# EAGLE design PwrSwHs1_0 (EAGLE 6.3)
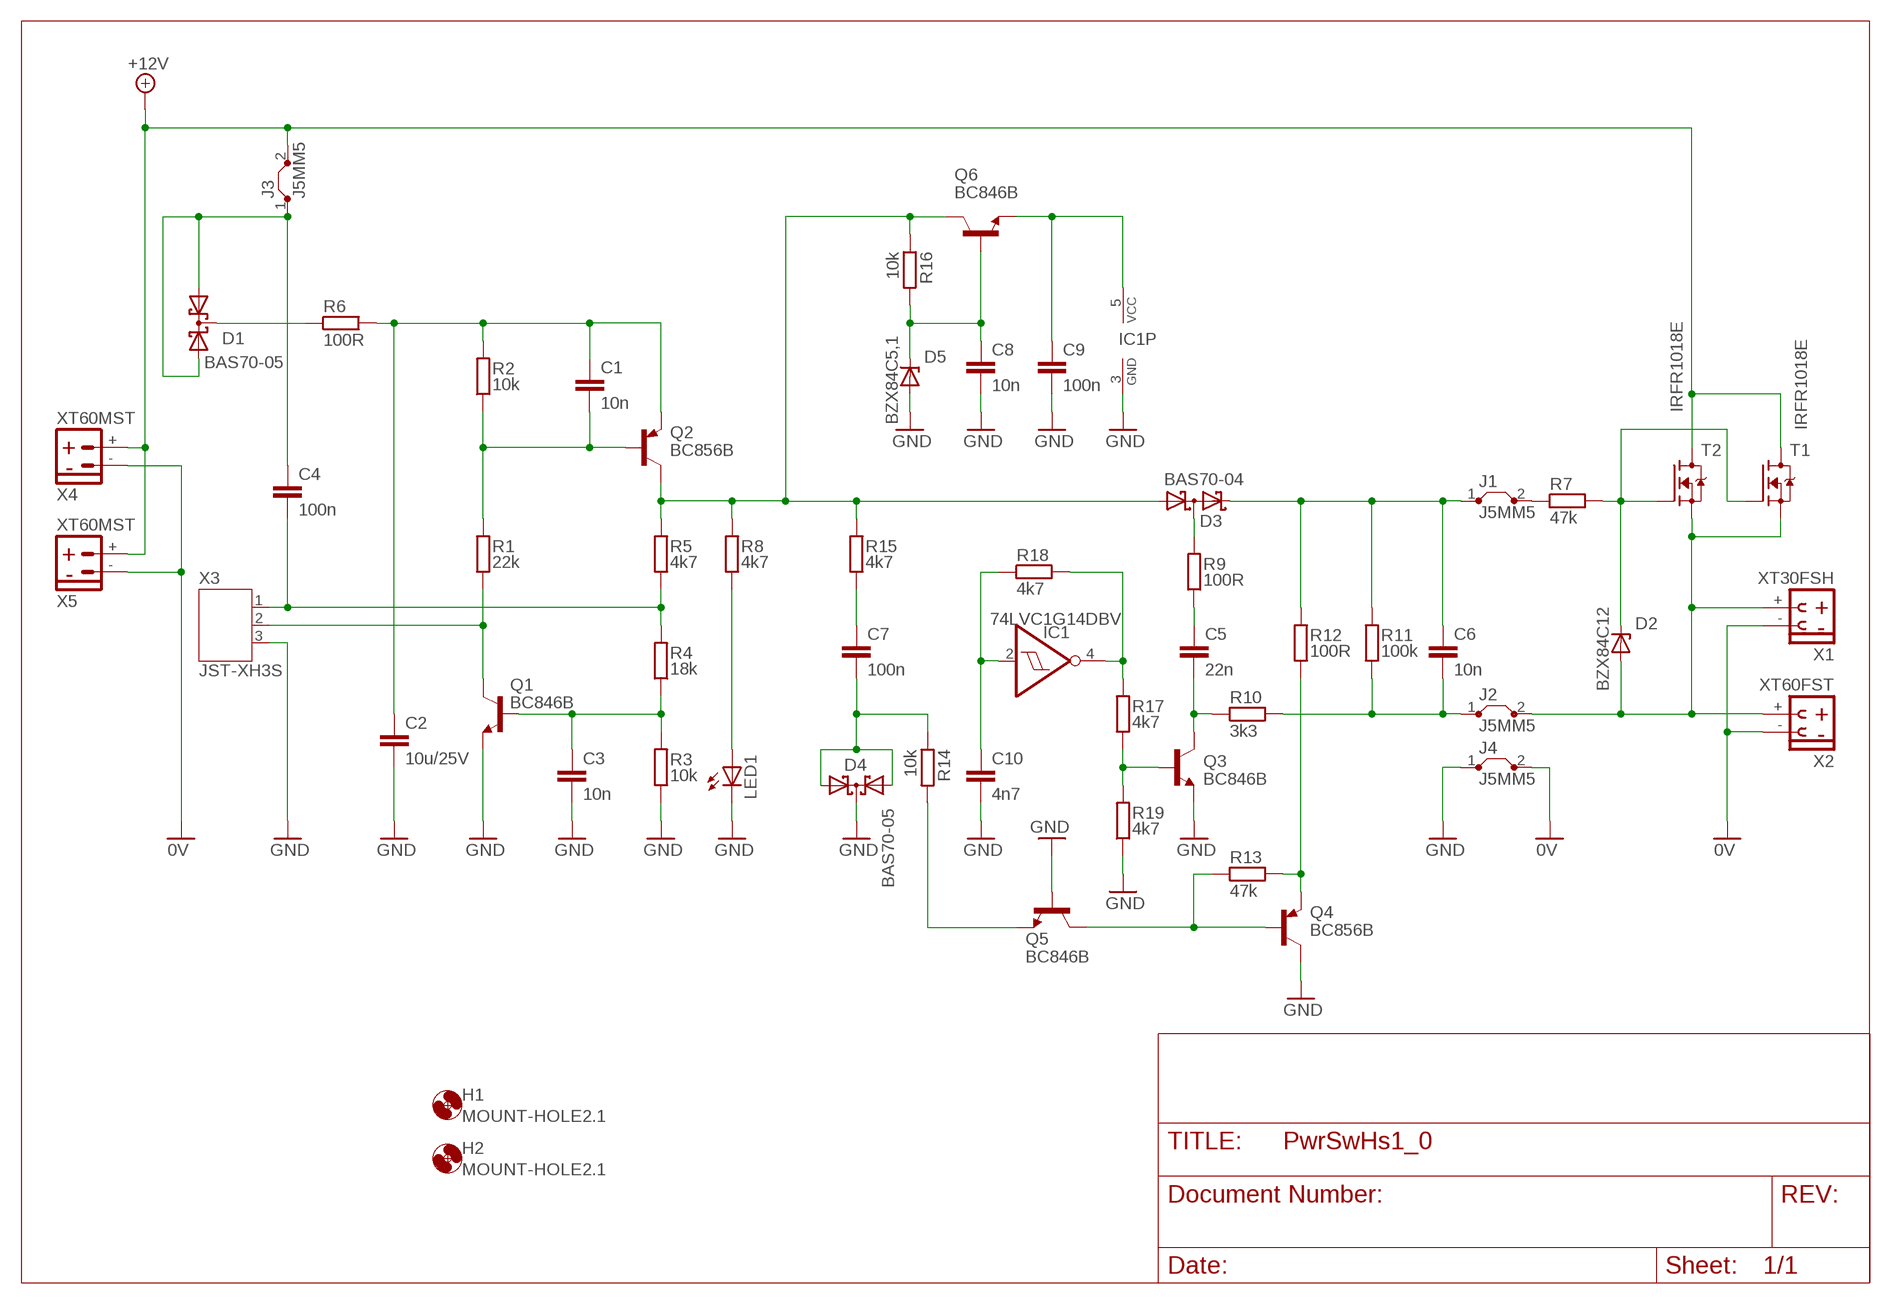
[diagram p0: schematic, sheet 1]

## Parts
C1  10n  C-EUC0805  [C0805]
C2  10u/25V  C-EUC1210  [C1210]
C3  10n  C-EUC0805  [C0805]
C4  100n  C-EUC0805  [C0805]
C5  22n  C-EUC0805  [C0805]
C6  10n  C-EUC0805  [C0805]
C7  100n  C-EUC0805  [C0805]
C8  10n  C-EUC0805  [C0805]
C9  100n  C-EUC0805  [C0805]
C10  4n7  C-EUC0805  [C0805]
D1  BAS70-05  [SOT23]
D2  BZX84C12  BZX84CSMD  [TO236]
D3  BAS70-04  [SOT23]
D4  BAS70-05  [SOT23]
D5  BZX84C5,1  BZX84CSMD  [TO236]
H1  MOUNT-HOLE2.1  [2,1]
H2  MOUNT-HOLE2.1  [2,1]
IC1  74LVC1G14DBV  [SOT23-5]
J1  J5MM5  [053]
J2  J5MM5  [053]
J3  J5MM5  [053]
J4  J5MM5  [053]
LED1  LEDLED3MML  [LED3MML]
Q1  BC846B  BC846BSMD  [SOT23]
Q2  BC856B  BC856BSMD  [SOT23-BEC]
Q3  BC846B  BC846BSMD  [SOT23]
Q4  BC856B  BC856BSMD  [SOT23-BEC]
Q5  BC846B  BC846BSMD  [SOT23]
Q6  BC846B  BC846BSMD  [SOT23]
R1  22k  R-EU_R0805  [R0805]
R2  10k  R-EU_R0805  [R0805]
R3  10k  R-EU_R0805  [R0805]
R4  18k  R-EU_R0805  [R0805]
R5  4k7  R-EU_R0805  [R0805]
R6  100R  R-EU_R0805  [R0805]
R7  47k  R-EU_R0805  [R0805]
R8  4k7  R-EU_R0805  [R0805]
R9  100R  R-EU_R0805  [R0805]
R10  3k3  R-EU_R0805  [R0805]
R11  100k  R-EU_R0805  [R0805]
R12  100R  R-EU_R0805  [R0805]
R13  47k  R-EU_R0805  [R0805]
R14  10k  R-EU_R0805  [R0805]
R15  4k7  R-EU_R0805  [R0805]
R16  10k  R-EU_R0805  [R0805]
R17  4k7  R-EU_R0805  [R0805]
R18  4k7  R-EU_R0805  [R0805]
R19  4k7  R-EU_R0805  [R0805]
T1  IRFR1018E  MOSFET-N-CHTO252  [TO252]
T2  IRFR1018E  MOSFET-N-CHTO252  [TO252]
X1  XT30FSH  [XT30F-SH]
X2  XT60FST  [XT60F-ST]
X3  JST-XH3S  [JST-XH3SMD]
X4  XT60MST  [XT60M-ST]
X5  XT60MST  [XT60M-ST]

## Nets
0V: J4.2 X1.- X2.- X4.- X5.-
+4V5: C9.1 IC1.5(VCC) Q6.2(E)
+12V: J3.2 T1.3(D) T2.3(D) X4.+ X5.+
+12V_SW: D3.1(A1) Q2.C Q6.3(C) R5.2 R8.2 R15.2 R16.1
+12VB: C4.1 D1.1(A1) D1.2(A2) J3.1
GATE: C6.1 D3.2(C2) J1.1 R11.2 R12.2
GATE_LIM: D2.C R7.2 T1.1(G) T2.1(G)
GATEB: J1.2 R7.1
GND: C2.2 C3.2 C8.2 C9.2 C10.2 D4.3(C) D5.A IC1.3(GND) J4.1 LED1.K(C) Q1.2(E) Q3.2(E) Q4.C Q5.1(B) R3.1 R19.1 X3.3
N$1: LED1.A R8.1
N$2: C5.2 Q3.3(C) R10.1
N$3: D3.3(C1A2) R9.2
N$4: C5.1 R9.1
N$5: C1.2 Q2.B R1.2 R2.1
N$6: C1.1 C2.1 Q2.E R2.2 R6.2
N$8: C3.1 Q1.1(B) R3.2 R4.1
N$10: C7.2 D4.1(A1) D4.2(A2) R14.1
N$11: Q3.1(B) R17.1 R19.2
N$12: Q4.E R12.1 R13.2
N$13: D1.3(C) R6.1
N$14: Q4.B Q5.3(C) R13.1
N$15: C7.1 R15.1
N$17: Q5.2(E) R14.2
N$18: C8.1 D5.C Q6.1(B) R16.2
N$21: C10.1 IC1.2(I) R18.1
N$22: IC1.4(O) R17.2 R18.2
OFF: C4.2 R4.2 R5.1 X3.1
ON: Q1.3(C) R1.1 X3.2
V_OUT: C6.2 J2.1 R10.2 R11.1
V_OUTB: D2.A J2.2 T1.2(S) T2.2(S) X1.+ X2.+

## Library data of the parts
C1-C10 = rcl:C-EU: CAPACITOR, European symbol
D1 D4 = diode:BAS70-05: Silicon Schottky Diodes General-purpose diode for high-speed switching
D2 D5 = diode:BZX84CSMD: Z DIODE
D3 = diode:BAS70-04: Silicon Schottky Diodes General-purpose diode for high-speed switching
H1 H2 = holes:MOUNT-HOLE: MOUNTING HOLE with drill center marker
IC1 = 74xx-little-de:74*1G14: Single Schmitt-Trigger Inverter Gate
J1-J4 = jumper:J: Bridge
LED1 = led:LED: LED OSRAM: - CHIPLED LG R971, LG N971, LY N971, LG Q971, LY Q971, LO R971, LY R971 LH N974, LH R974 LS Q976, LO Q976, LY Q976 LO Q996 - Hyper CHIPLED LW Q18S LB Q993, LB Q99A, LB R99A - SideLED LS A670, LO A670, LY A670, LG A670, LP A670 LB A673, LV A673, LT A673, LW A673 LH A674 LY A675 LS A676, LA A676, LO A676, LY A676, LW A676 LS A679, LY A679, LG A679 - Hyper Micro SIDELED® LS Y876, LA Y876, LO Y876, LY Y876 LT Y87S - SmartLED LW L88C, LW L88S LB L89C, LB L89S, LG L890 LS L89K, LO L89K, LY L89K LS L896, LA L896, LO L896, LY L896 - TOPLED LS T670, LO T670, LY T670, LG T670, LP T670 LSG T670, LSP T670, LSY T670, LOP T670, LYG T670 LG T671, LOG T671, LSG T671 LB T673, LV T673, LT T673, LW T673 LH T674 LS T676, LA T676, LO T676, LY T676, LB T676, LH T676, LSB T676, LW T676 LB T67C, LV T67C, LT T67C, LS T67K, LO T67K, LY T67K, LW E67C LS E67B, LA E67B, LO E67B, LY E67B, LB E67C, LV E67C, LT E67C LW T67C LS T679, LY T679, LG T679 LS T770, LO T770, LY T770, LG T770, LP T770 LB T773, LV T773, LT T773, LW T773 LH T774 LS E675, LA E675, LY E675, LS T675 LS T776, LA T776, LO T776, LY T776, LB T776 LHGB T686 LT T68C, LB T68C - Hyper Mini TOPLED® LB M676 - Mini TOPLED Santana® LG M470 LS M47K, LO M47K, LY M47K Source: http://www.osram.convergy.de LUXEON: - LUMILED® LXK2-PW12-R00, LXK2-PW12-S00, LXK2-PW14-U00, LXK2-PW14-V00 LXK2-PM12-R00, LXK2-PM12-S00, LXK2-PM14-U00 LXK2-PE12-Q00, LXK2-PE12-R00, LXK2-PE12-S00, LXK2-PE14-T00, LXK2-PE14-U00 LXK2-PB12-K00, LXK2-PB12-L00, LXK2-PB12-M00, LXK2-PB14-N00, LXK2-PB14-P00, LXK2-PB14-Q00 LXK2-PR12-L00, LXK2-PR12-M00, LXK2-PR14-Q00, LXK2-PR14-R00 LXK2-PD12-Q00, LXK2-PD12-R00, LXK2-PD12-S00 LXK2-PH12-R00, LXK2-PH12-S00 LXK2-PL12-P00, LXK2-PL12-Q00, LXK2-PL12-R00 Source: www.luxeon.com KINGBRIGHT: KA-3528ASYC Source: www.kingbright.com
Q1 Q3 Q5 Q6 = transistor-npn:BC846*: NPN Transistor
Q2 Q4 = transistor-pnp:BC856*: PNP Transistror
R1-R19 = rcl:R-EU_: RESISTOR, European symbol
T1 T2 = transistor-fet:MOSFET-N-CH
X1 = con-accu:XT30F
X2 = con-accu:XT60F
X3 = jst-ph-xh:JST-XH3
X4 X5 = con-accu:XT60M

## Board
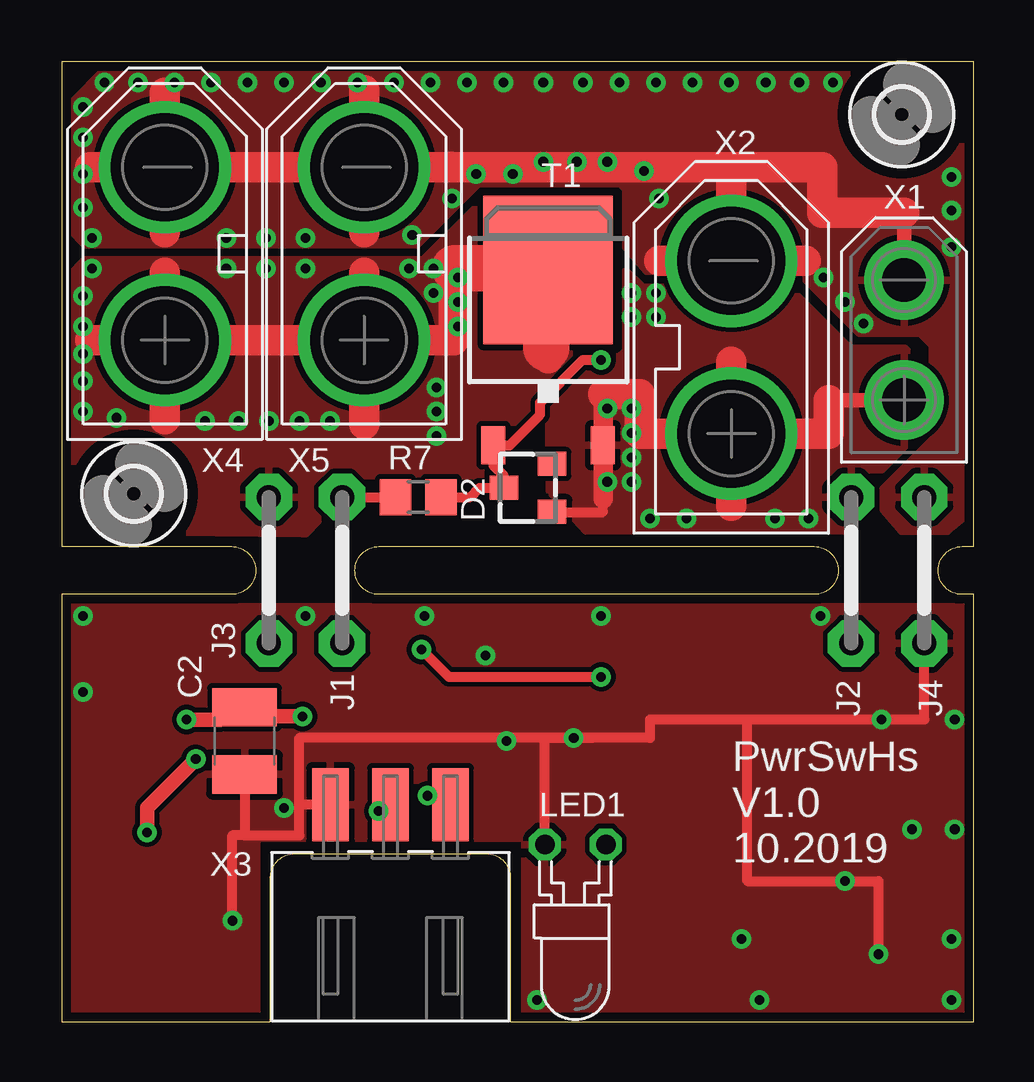
[diagram p1: board, top side]
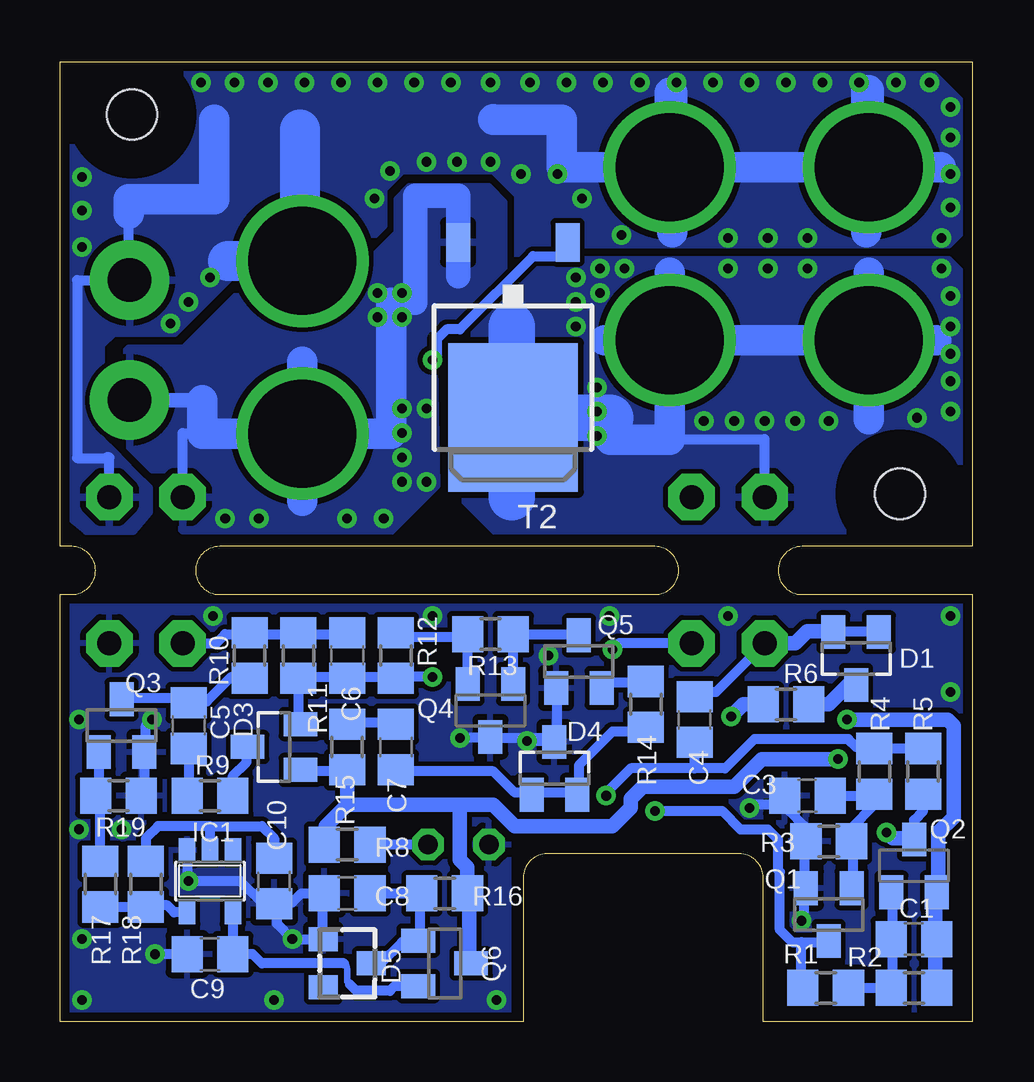
[diagram p2: board, bottom side, seen from below]

Size 38 x 40 mm. Coordinates in mm from the lower left corner, seen from the top.
Outline: 38,19.8 38,40 0,40 0,19.8 7.08,19.8 arc-180 7.08,17.8 0,17.8 0,0 8.7,0 8.7,6 arc-90 9.7,7 17.7,7 arc-90 18.7,6 18.7,0 38,0 38,17.8 37.52,17.8 arc-180 37.52,19.8 38,19.8
Outline: 13.22,19.8 31.35,19.8 arc-180 31.35,17.8 13.22,17.8 arc-180 13.22,19.8
Copper layers (1*16): Top 0.035mm / dielectric 1.5mm / Bottom 0.035mm
Design rules "default *": minimum track width 5mil, minimum drill 10mil, track to track 8mil, track to pad 8mil, pad to pad 8mil, via to via 8mil, smd to smd 5mil, copper to edge 15mil, drill to drill 8mil, minimum pad ring 10mil, minimum via ring 8mil, stop-mask expansion 4mil, vias tented up to drill 0.6mm, thermal gap 10mil
Milling: 22 lines

### Footprints (pad centres in the part's own frame; a part is rotated, then mirrored left to right if it is on the bottom)
C0805 = smd 1.3 x 1.5: 1 -0.95,0; 2 0.95,0
C1210 = smd 1.6 x 2.7: 1 -1.4,0; 2 1.4,0
SOT23 = smd 1 x 1.4: 1 -0.95,-1.1; 2 0.95,-1.1; 3 0,1.1
TO236 = smd 1 x 1.2: A -1,-1; C 0,1; NC 1,-1
2,1 = hole 2.1: 0,0
SOT23-5 = smd 0.69 x 0.99: 1 -0.95,-1.29; 2 0,-1.29; 3 0.95,-1.29; 4 0.95,1.3; 5 -0.95,1.3
053 = drill 1 pad 1.93 octagon: 1 -3.048,0; 2 3.048,0
LED3MML = drill 0.813 octagon: A -1.27,0; K 1.27,0
SOT23-BEC = smd 1 x 1.4: B -0.95,-1.1; C 0,1.1; E 0.95,-1.1
R0805 = smd 1.3 x 1.5: 1 -0.95,0; 2 0.95,0
TO252 = smd 1 x 1.6: 1 -2.28,-4.8; 2 2.28,-4.8 | smd 5.4 x 6.2: 3 0,2.5
XT30F-SH = drill 1.8 pad 3.3: + -0.1,2.5; - -0.1,-2.5
XT60F-ST = drill 4.5: + 0,3.6; - 0,-3.6
JST-XH3SMD = smd 1.524 x 3.048: 1 -2.5,-4.5; 2 0,-4.5; 3 2.5,-4.5
XT60M-ST = drill 4.5: + 0,3.6; - 0,-3.6

### Placement (x,y rotation side)
C1  2.41,3.45 180 bottom
C2  7.62,11.7 270 top
C3  6.86,9.41 180 bottom
C4  11.56,12.59 270 bottom
C5  32.64,12.34 90 bottom
C6  26.04,15.26 90 bottom
C7  24,11.45 270 bottom
C8  26.04,5.35 180 bottom
C9  31.75,2.81 180 bottom
C10  29.08,5.86 270 bottom
D1  4.83,15.13 180 bottom
D2  19.43,22.24 90 top
D3  29.08,11.45 90 bottom
D4  17.4,10.56 0 bottom
D5  26.04,2.43 270 bottom
H1  35,37.8 0 top
H2  3,22 0 top
IC1  31.75,5.86 180 bottom
J1  11.68,18.81 90 top
J2  32.89,18.81 90 top
J3  8.64,18.81 90 top
J4  35.94,18.81 90 top
LED1  21.4,7.38 180 top
Q1  5.97,4.46 180 bottom
Q2  2.41,6.49 0 bottom
Q3  35.43,12.34 0 bottom
Q4  20.07,12.97 180 bottom
Q5  16.38,15 0 bottom
Q6  21.97,2.43 270 bottom
R1  6.1,1.41 0 bottom
R2  2.41,1.41 0 bottom
R3  5.97,7.51 0 bottom
R4  4.06,10.43 90 bottom
R5  2.03,10.43 270 bottom
R6  7.75,13.22 180 bottom
R7  14.86,21.86 0 top
R8  26.04,7.38 180 bottom
R9  31.75,9.41 0 bottom
R10  30.1,15.26 90 bottom
R11  28.07,15.26 270 bottom
R12  24,15.26 270 bottom
R13  20.07,16.14 180 bottom
R14  13.59,13.22 90 bottom
R15  26.04,11.45 270 bottom
R16  21.97,5.35 180 bottom
R17  36.32,5.73 270 bottom
R18  34.42,5.73 270 bottom
R19  35.56,9.41 180 bottom
T1  20.27,28.82 0 top
T2  19.13,27.67 180 bottom
X1  35,28.4 180 top
X2  27.9,28.1 180 top
X3  13.7,4.54 180 top
X4  4.3,32 180 top
X5  12.6,32 180 top

### Tracks (layer width: path | path; a pad name or v marks a point on that pad's centre or on a via)
0V  (via drill 0.4 pad 0.81)
  Top 0.61: X1.- 35.1,33.7
  Top 1.27: 12.6,38.8 X5.- | 12.6,32.9 X5.- | X5.- X4.- | X4.- 4.3,32.9 | 4.3,38.7 X4.- | 1.2,35.6 X4.- | X5.- 16.21,35.6 16.21,35.62 | X2.- 31,31.7 | 24.9,31.7 X2.- | X2.- 27.9,35.6 | 27.9,35.6 16.3,35.6 | 35.1,33.7 31.7,33.7 31.7,35.6 27.9,35.6
  Bottom 0.406: 35.13,33.66 35.13,30.9 37.29,30.9 37.29,23.48 36.02,23.48 | J4.2 35.94,23.51 36.07,23.51
  Bottom 1.27: 1.3,35.6 X4.- 4.3,38.8 4.4,38.8 4.4,35.6 | 4.4,32.9 4.4,35.6 | 4.4,35.6 12.5,35.6 | 12.5,35.6 12.5,32.9 | 12.5,35.6 12.5,38.7 12.6,38.7 X5.- 17.09,35.6 17.09,37.58 19.94,37.58 19.94,37.61 | X2.- 28,31.7 28,31.8 | 35.13,33.66 35.13,34.28 31.57,34.28 31.57,37.58
  Bottom 1.676: 31,31.7 28,31.7 | 28,31.8 28,37.17
  other vias: 1.27,32.66 4.7,39.13 6.22,39.13 7.75,39.13 1.78,39.13 3.17,39.13 13.84,39.13 16.89,39.13 15.37,39.13 21.72,39.13 12.32,39.13 6.86,32.66 8.51,32.66 30.73,39.13 32.13,39.13 9.27,39.13 10.79,39.13 23.24,39.13 18.41,39.13 20.07,39.13 24.77,39.13 26.29,39.13 27.81,39.13 29.34,39.13 10.16,32.66 37.08,35.2 37.08,33.8 37.08,32.27 0.89,38.12 0.89,36.85 0.89,35.32 0.89,33.92 14.61,32.78 31.75,31 32.64,29.99 33.4,29.1 16.26,34.31 17.27,35.32 18.8,35.32 20.07,35.83 21.46,35.83 22.73,35.83 24.26,35.45 24.89,34.31
  pour Bottom (rank 5): 36.53,39.74 37.67,38.47 37.67,21.07 36.91,20.43 34.95,20.43 34.29,21.23 34.29,22.24 34.92,22.88 35.76,23.74 36.27,24.25 36.27,28.18 35.76,28.69 33.22,28.69 30.56,31.36 25.65,31.38 25.65,32.02 24.51,33.16 24.51,34.69 23.75,35.45 19.94,35.45 18.92,34.43 18.92,31.77 18.54,31.38 17.55,32.37 0.97,32.37 0.33,33.01 0.33,38.22 1.85,39.74
  pour Top: 36.91,20.43 37.67,21.07 37.67,38.47 36.53,39.74 1.85,39.74 0.33,38.22 0.33,33.01 0.97,32.37 14.81,32.37 17.35,34.91 23.32,34.91 23.32,34.86 23.5,34.69 23.5,32.27 24.38,31.26 30.68,31.23 33.22,28.69 35.76,28.69 36.27,28.18 36.27,24.25 34.24,22.21 34.24,21.32 35,20.43
+4V5
  Bottom 0.254: 25.91,1.54 26.04,1.67 | 26.04,2.17 26.04,2.3 26.16,2.43
  Bottom 0.279: 26.04,1.67 26.04,2.17
  Bottom 0.406: IC1.5 C9.1 29.97,2.81 29.59,2.43 26.16,2.43 | Q6.2 24.06,1.48 24.26,1.29 25.65,1.29 25.91,1.54
+12V  (via drill 0.4 pad 0.81)
  Top 0.813: 16.33,31.32 16.33,31.34 16.38,31.38
  Top 1.27: 12.6,31.2 X5.+ | 12.6,24.9 X5.+ | X5.+ X4.+ | 1.2,28.4 X4.+ | X4.+ 4.3,25.1 | 4.3,31.2 X4.+ | X5.+ 16.33,28.4 16.33,31.32 | T1.3 20.27,27.65
  Top 1.93: 20.19,28.08 20.19,31.38 16.38,31.38
  Bottom 0.406: J3.2 8.64,24.27 12.57,24.27
  Bottom 1.27: X5.+ 15.3,28.4 | X5.+ X4.+ | 4.3,31.2 X4.+ | 4.3,25.1 X4.+ | 1.5,28.4 X4.+ | X5.+ 12.6,31.2 | X5.+ 12.6,24.25 15.06,24.25 15.06,25.17 | 19.18,25.16 19.18,25.17 T2.3
  Bottom 1.93: 19.18,25.16 15.24,25.16 15.24,25.17 15.06,25.17 | 19.18,28.97 19.18,25.17 19.18,21.86
  other vias: 16.51,31 16.51,29.99 15.49,30.37 15.49,31.38 16.51,28.97 15.62,26.43 15.62,25.42 15.62,24.4 10.16,31.38 14.48,31.38 8.51,31.38 6.86,31.38 1.27,31.38 0.89,30.24 0.89,28.97 0.89,27.83 0.89,26.69 0.89,25.42 2.29,25.16 5.97,25.04 7.37,25.04 8.64,25.04 9.91,25.04 11.18,25.04
  pour Bottom: 19.89,20.43 16.51,20.46 0.97,20.43 0.33,21.07 0.33,31.1 0.97,31.74 17.81,31.74 arc-90 18.16,31.38 21.54,28.05 21.54,22.09
  pour Top (rank 3): 19.51,26.15 19.51,24.35 17.91,22.75 11.18,22.75 10.74,22.34 10.67,20.84 10.16,20.34 10.03,20.34 0.97,20.43 0.33,21.07 0.33,31.1 0.97,31.74 15.06,31.74 17.22,33.9 22.05,33.9 22.68,33.26 22.68,29.32
+12V_SW  (via drill 0.4 pad 0.81)
  Top 0.61: v5.59,10.94 3.56,8.91 v3.56,7.89
  Bottom 0.305: 2.46,7.64 Q2.C
  Bottom 0.406: R15.2 26.04,10.43 27.98,10.43 D3.1 | Q6.3 20.95,2.43 | 20.95,5.28 R16.1 | 26.92,7.44 R8.2 | Q2.C 2.41,8.4 2.03,8.78 R5.2
  Bottom 0.61: 20.95,2.43 20.95,5.28 | R16.1 21.02,6.43 21.34,6.75 21.34,9.03 | 21.34,9.03 26.04,9.03 | 26.04,9.03 26.92,8.14 26.92,7.44 | 26.04,10.43 26.04,9.03 | 21.34,9.03 19.94,9.03 19.05,8.14 14.99,8.14 14.22,8.91 14.22,9.29 13.72,9.79 9.91,9.79 8.76,10.94 v5.59,10.94 | v3.56,7.89 3.3,7.64 2.46,7.64
+12VB
  Bottom 0.406: 5.82,16.27 5.84,16.27 5.8,16.23 D1.2 5.82,16.27 | 5.82,16.27 3.92,16.27 D1.1 | J3.1 10.67,13.73 11.36,13.73 C4.1
  Bottom 0.61: 5.84,16.27 6.86,16.27 7.37,15.76 J3.1
GATE  (via drill 0.4, 0.4 pad 0.81)
  Top 0.406: v14.99,15.51 16.13,14.37 v22.48,14.37
  Bottom 0.406: D3.2 28.07,12.4 R11.2 28.07,14.37 26.04,14.37 | C6.1 26.04,14.37 | 26.04,14.37 24,14.37 R12.2 23.94,14.37 v22.48,14.37 | J1.1 14.73,15.76 v14.99,15.51
GATE_LIM  (via drill 0.4 pad 0.81)
  Top 0.406: R7.2 17.02,21.86 17.4,22.24 D2.C 18.41,22.26 18.41,22.75 17.99,23.17 T1.1 18.67,24.02 19.94,25.29 19.94,25.8 21.72,27.57 v22.48,27.57
  Bottom 0.406: T2.1 16.85,31.99 16.94,31.89 18.29,31.89 21.34,28.84 21.89,28.84 22.3,28.44 22.3,27.75 v22.48,27.57
GATEB
  Top 0.406: J1.2 R7.1
GND  (via drill 0.4 pad 0.81)
  Top 0.406: J4.1 35.94,12.59 v34.16,12.59 28.57,12.59 | v21.34,11.83 24.51,11.83 24.51,12.59 28.57,12.59 | v21.34,11.83 9.91,11.83 9.91,9.16 | 28.57,12.59 28.57,5.86 v32.64,5.86 34.04,5.86 v34.04,2.81 | v21.34,11.83 22.1,11.83 | 9.91,9.16 9.91,7.76 7.62,7.76 | LED1.K 20.13,11.83 v21.34,11.83 | v7.11,4.21 7.11,7.76 7.62,7.76 | X3.3 10.02,9.04 9.91,9.16 | C2.2 7.62,7.76
  Bottom 0.406: R19.1 34.48,9.54 Q3.2 34.48,11.25 34.42,11.32 34.42,12.34 v34.16,12.59 | C9.2 v34.04,2.81 | 20.07,11.83 v21.34,11.83 | IC1.3 32.7,5.92 v32.64,5.86 30.48,5.86 29.59,4.97 29.02,4.97 | 29.02,4.97 C10.2 | 27.04,5.3 C8.2 27.05,5.35 | 6.99,7.44 R3.1 6.99,7.51 | 6.99,7.51 7.11,7.51 7.11,7.64 6.99,7.51 | 17.4,13.9 Q5.1 17.27,13.84 17.27,11.7 17.36,11.7 D4.3 | Q4.C 20.07,11.83 | 20.07,11.83 17.4,11.83 D4.3 | 6.99,7.51 6.99,5.63 | 6.99,5.63 Q1.2 | v7.11,4.21 6.99,4.33 6.99,5.63 | 6.99,7.51 6.99,8.14 7.62,8.78 7.62,8.91 7.75,8.91 7.75,9.03 | 7.75,9.41 7.75,9.54 | 29.02,4.97 28.96,4.97 | 28.96,4.97 28.32,4.97 27.94,5.35 27.05,5.35 | 27.05,5.35 D5.A 28.3,3.43 | 7.93,9.54 C3.2 7.75,9.41 | v18.54,11.7 17.4,11.7 D4.3 | 7.75,9.41 7.75,9.03 | 7.75,9.03 9.27,9.03 v9.27,8.91 | v28.32,3.45 28.96,4.08 28.96,4.97
  other vias: 0.89,16.91 0.89,13.73 10.16,16.91 15.11,16.91 31.62,16.91 22.48,16.91 37.21,8.02 37.08,3.45 37.08,0.91 29.08,0.91 19.81,0.91 37.21,12.59 35.43,8.02 17.65,15.26
  pour Top: 0.25,17.29 0.25,0.27 8.13,0.23 8.13,7.64 19.3,7.64 19.3,0.27 37.72,0.27 37.72,17.29
  pour Bottom: 0.25,0.27 0.25,17.29 37.72,17.29 37.72,0.27 19.3,0.27 19.3,7.64 8.13,7.64 8.13,0.27
N$1
  Bottom 0.406: LED1.A R8.1
N$2
  Bottom 0.406: R10.1 30.1,14.37 30.86,14.37 31.88,13.35 32.57,13.35 C5.2 32.64,13.48 35.39,13.48 Q3.3
N$3
  Bottom 0.406: R9.2 30.8,10.24 30.23,10.81 30.23,11.4 D3.3
N$4
  Bottom 0.406: C5.1 32.64,9.47 R9.1
N$5
  Bottom 0.406: R1.2 R2.1 3.36,1.29 3.3,1.29 3.3,3.45 | C1.2 3.3,3.45 | 3.3,3.45 3.3,5.39 Q2.B
N$6  (via drill 0.4 pad 0.81)
  Top 0.406: 7.62,12.72 6.86,12.72 6.86,12.84 6.6,12.59 | 7.87,12.72 7.62,12.72 | C2.1 7.62,12.72
  Top 0.61: 6.6,12.59 v5.21,12.59 | v10.03,12.72 7.62,12.72
  Bottom 0.406: R2.2 1.52,1.41 | C1.1 1.52,3.45 | 1.48,5.39 Q2.E | 1.52,5.39 1.48,5.39 | 1.48,5.39 1.4,5.48 | 8.76,13.16 R6.2
  Bottom 0.61: 1.52,1.41 1.52,3.45 1.52,5.39 | 1.4,5.48 1.4,7.89 0.76,8.53 0.76,12.34 1.02,12.59 v5.21,12.59 | R6.2 9.53,13.22 v10.03,12.72
N$8
  Bottom 0.406: C3.1 4.12,9.41 4.12,9.48 R4.1 4.06,9.03 5.02,8.08 R3.2 4.95,7.44 4.95,5.6 5,5.56 Q1.1
N$10
  Bottom 0.406: 16.36,9.54 D4.2 | D4.2 16.45,9.48 16.51,9.54 18.27,9.54 D4.1 18.35,9.47 18.41,9.54 19.05,9.54 19.94,10.43 23.94,10.43 C7.2 | D4.2 16.38,9.52 16.38,10.68 14.99,12.08 13.72,12.08 13.59,12.21 R14.1
N$11
  Bottom 0.406: Q3.1 36.38,9.54 R19.2 36.45,9.35 36.45,9.41 36.32,9.41 R17.1
N$12
  Bottom 0.406: R12.1 24,16.02 21.21,16.02 21.02,16.02 R13.2 Q4.E
N$13
  Bottom 0.406: D1.3 5.16,14.03
  Bottom 0.61: 5.16,14.03 5.97,13.22 R6.1
N$14
  Bottom 0.406: Q4.B R13.1 16.38,16.14 Q5.3
N$15
  Bottom 0.406: C7.1 24.13,12.4 24.13,12.46 26.04,12.46 R15.1
N$17
  Bottom 0.406: R14.2 13.65,14.17 13.72,14.11 15.22,14.11 Q5.2
N$18
  Bottom 0.406: D5.C 24.64,2.43 23.75,3.32 23.13,3.32 Q6.1 23.05,3.38 22.99,3.32 22.99,5.28 R16.2 C8.1
N$21
  Bottom 0.406: 31.75,8.14 33.91,8.14 34.42,7.64 R18.1 | IC1.2 31.75,8.14 | 31.75,8.14 29.59,8.14 29.08,7.64 C10.1
N$22
  Bottom 0.406: IC1.4 33.24,4.56 33.53,4.84 34.42,4.84 R18.2 R17.2
OFF  (via drill 0.4 pad 0.81)
  Top 0.406: v15.24,9.41 15.83,9.41 X3.1
  Bottom 0.406: R5.1 R4.2 4.06,11.45 4.83,11.45 5.16,11.78 9.07,11.78 10.29,10.56 11.56,10.56 | 11.56,10.56 C4.2 | 11.56,10.56 14.22,10.56 15.24,9.54 v15.24,9.41
ON  (via drill 0.4 pad 0.81)
  Top 0.305: v13.21,8.78 13.46,8.78 13.56,8.88 13.56,8.91 X3.2
  Top 0.406: X3.2
  Bottom 0.406: 7.11,3.32 7.49,3.32 8,3.83 8,6.24 8.08,6.32 8.08,7.59 8.51,8.02 9.65,8.02 10.41,8.78 v13.21,8.78 | 7.11,3.32 6.01,3.32 Q1.3 | R1.1 7.11,1.41 7.11,3.32
V_OUT
  Bottom 0.406: J2.1 31.5,15.76 31.11,16.14 30.1,16.14 | R10.2 30.1,16.14 | 30.1,16.14 28.07,16.14 | R11.1 28.07,16.14 | 28.07,16.14 26.04,16.14 C6.2
V_OUTB  (via drill 0.4 pad 0.81)
  Top 0.406: T1.2 22.55,21.26 22.51,21.23 20.45,21.23 D2.A
  Top 0.61: X1.+ 31.95,25.9
  Top 0.813: 22.56,21.78 22.56,25.72 22.99,26.15
  Top 1.27: X2.+ 31.95,24.5 31.95,25.9 | 22.56,26.15 22.99,26.15 24.08,26.15 24.08,24.5 X2.+ | 27.9,27.5 X2.+ | 27.9,21.5 X2.+
  Bottom 0.406: J2.2 32.89,24.53 32.13,24.53
  Bottom 0.61: X1.+ 32.08,25.9
  Bottom 1.016: 24.21,29.96 23.19,29.96 23.19,34.41 21.41,34.41 21.41,31.05 | T2.2
  Bottom 1.27: X2.+ 32.08,24.5 32.08,25.9 | 27.9,21.7 X2.+ | 27.9,27.5 X2.+ | X2.+ 24.21,24.5 24.21,29.96
  other vias: 22.73,22.5 23.75,22.5 23.75,23.51 23.75,24.53 23.75,25.54 22.73,25.54 23.75,30.37 23.75,29.35 24.77,30.37 24.77,29.35 24.51,20.97 26.04,20.97 29.72,20.97 31.11,20.97
  pour Bottom (rank 4): 35.13,28.05 32.84,28.05 30.3,30.59 26.24,30.59 23.95,32.88 23.95,34.28 23.45,34.79 20.14,34.79 19.51,34.15 19.51,31.23 22.43,28.31 22.3,22.34 24.21,20.43 32.89,20.46 33.1,20.69 33.1,22.45 33.66,23 34.16,23 35.81,24.65 35.76,27.42
  pour Top (rank 5): 35.13,28.05 32.84,28.05 30.3,30.59 24.21,30.59 23.5,31.28 23.5,27.96 23.24,27.7 21.59,27.7 20.27,26.4 20.32,22.11 21.84,20.46 32.89,20.46 33.15,20.72 33.15,22.5 33.66,23 34.16,23 35.81,24.65 35.76,27.42

### Text on the board
tNames: PwrSwHs / V1.0 / 10.2019